# Altium schematic sheet Sheet3.SchDoc: Наименование
size 209 x 297 mm; ApprovedBy: Утвердил; CheckedBy: Проверил; Author: Разработал; CompanyName: Организация; DrawnBy: Н.Контр; Engineer: Т.Контр; SheetNumber: 3; SheetTotal: 6; PageSetup: Record=PageOptions|CenterHorizontal=True|CenterVertical=True|PrintScale=0.94|XCorrection=1.00|YCorrection=1.00|PrintKind=1|BorderSize=5000000|LeftOffset=0|BottomOffset=0|Orientation=1|PaperLength=1000|PaperWidth=1000|Scale=100|PaperSource=7|PrintQuality=-4|MediaType=1|DitherType=10|PaperKind=A4|PrintScaleMode=1; DecimalNumber: Децимальный номер; HeadOfSector: Нач. сектора; MainDevice: Перв.примен.; Name: Наименование; DocumentName: Sheet1.SCHDOC
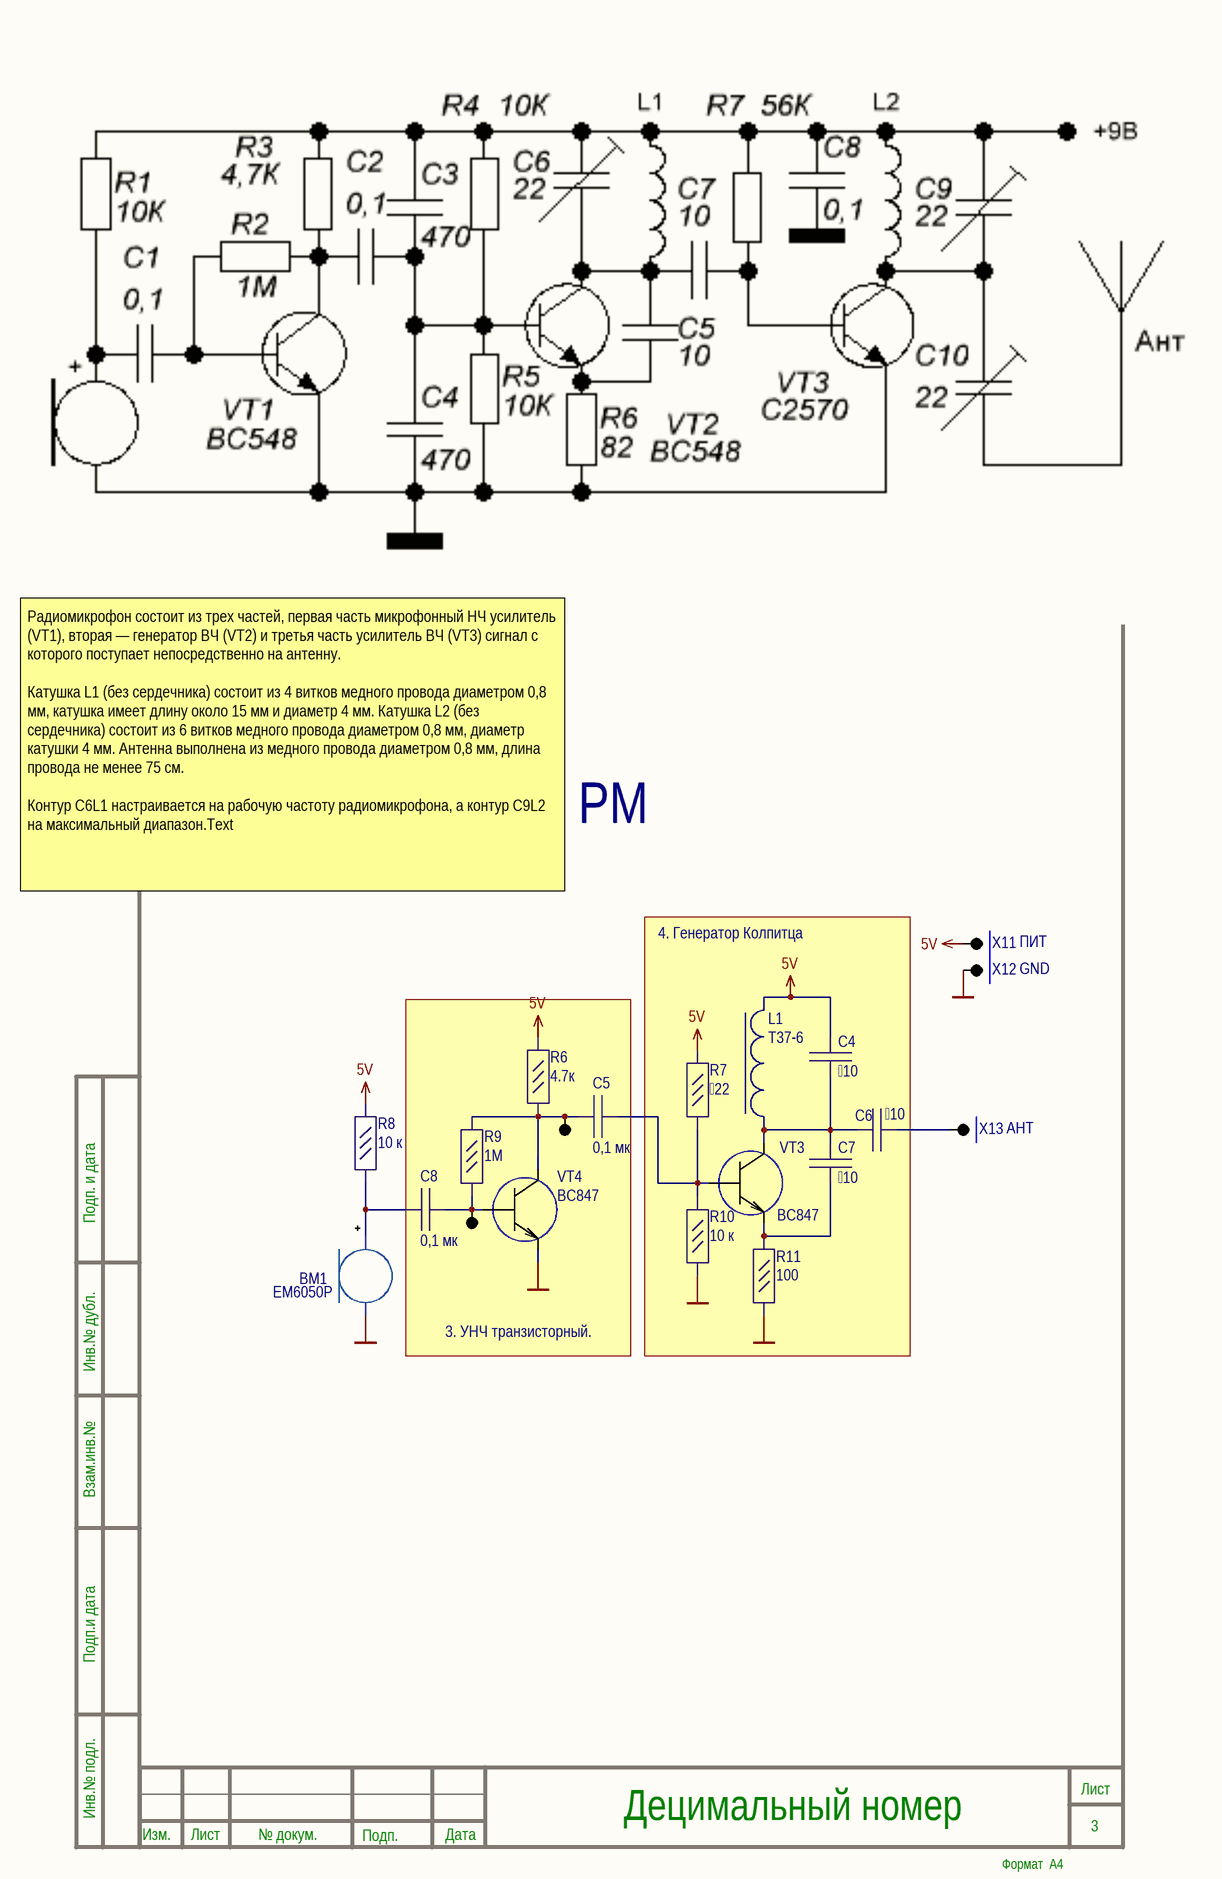
[diagram p0: Sheet3.SchDoc]

## Parts
BM1  EM6050P  [EM6050P]
C4  10  [C_0603]
C5  0,1 мк  [C_0603]
C6  10  [C_0603]
C7  10  [C_0603]
C8  0,1 мк  [C_0603]
L1  T37-6  [t37]
R6  4.7к  [R_0603]
R7  22  [R_0603]
R8  10 к  [R_0603]
R9  1М  [R_0603]
R10  10 к  [R_0603]
R11  100  [R_0603]
TP4  Test_Point_1  [Test_point]  (value not drawn)
TP5  Test_Point_1  [Test_point]  (value not drawn)
VT3  BC847  [SOT23]
VT4  BC847  [SOT23]
X11  КТ  [KT]  (value not drawn)
X12  КТ  [KT]  (value not drawn)
X13  КТ  [KT]  (value not drawn)

## Blocks framed on the sheet
4. Генератор Колпитца: C4 C6 C7 L1 R7 R10 R11 VT3
3. УНЧ транзисторный.: C5 C8 R6 R9 TP4 TP5 VT4

## Nets
5V: C4.1 L1.2 R6.1 R7.1 R8.1 X11.1
GND: BM1.2 R10.2 R11.2 VT4.2(E) X12.1
NetBM1_1: BM1.1 C8.1 R8.2
NetC4_2: C4.2 C6.2 C7.1 L1.1 VT3.3(C)
NetC5_1: C5.1 R6.2 R9.1 TP4.1 VT4.3(C)
NetC5_2: C5.2 R7.2 R10.1 VT3.1(B)
NetC6_1: C6.1 X13.1
NetC7_2: C7.2 R11.1 VT3.2(E)
NetC8_2: C8.2 R9.2 TP5.1 VT4.1(B)

## Notes on the sheet
- Радиомикрофон состоит из трех частей, первая часть микрофонный НЧ усилитель (VT1), вторая — генератор ВЧ (VT2) и третья часть усилитель ВЧ (VT3) сигнал с которого поступает непосредственно на антенну.
  Катушка L1 (без сердечника) состоит из 4 витков медного провода диаметром 0,8 мм, катушка имеет длину около 15 мм и диаметр 4 мм. Катушка L2 (без сердечника) состоит из 6 витков медного провода диаметром 0,8 мм, диаметр катушки 4 мм. Антенна выполнена из медного провода диаметром 0,8 мм, длина провода не менее 75 см.
  Контур С6L1 настраивается на рабочую частоту радиомикрофона, а контур С9L2 на максимальный диапазон.Text
- PM
- ПИТ
- GND
- (near X13) АНТ
- Подп. и дата
- Инв.№ дубл.
- Взам.инв.№
- Подп.и дата
- Инв.№ подл.
- Изм.
- Лист
- № докум.
- Подп.
- Дата
- Формат  A4

## Library data of the parts
C4-C8 = GRM188R72A104KA35D: CAP CER 0.1UF 100V X7R 0603; Manufacturer: Murata Electronics; Value: 0.1µF; Part Number: GRM188R72A104KA35D; ComponentLink1URL: https://www.murata.com/~/media/webrenewal/support/library/catalog/products/capacitor/mlcc/c02e.ashx?la=en-us; ComponentLink1Description: Datasheet; Component Type: Capasitor
R6 R7 R9 R11 = CR0603-FX-1002ELF: RES SMD 10K OHM 1% 1/10W 0603; Manufacturer: Bourns Inc.; Value: 10 к; Part Number: CR0603-FX-1002ELF; ComponentLink1URL: https://www.bourns.com/pdfs/chpreztr.pdf; ComponentLink1Description: Datasheet; Component Type: Resistor
R8 R10 = CR0603-FX-1002ELF: RES SMD 10K OHM 1% 1/10W 0603; Manufacturer: Bourns Inc.; Part Number: CR0603-FX-1002ELF; Value: 10 к; ComponentLink1URL: https://www.bourns.com/pdfs/chpreztr.pdf; ComponentLink1Description: Datasheet; Component Type: Resistor